# EasyEDA schematic BIT 2.json
TITLE: TRICORE | ALU | LOGIC; REV: 1.0; Date: 2022-01-06; Sheet: 4/9; Drawn By: Koehler, Paul; Company: komed3
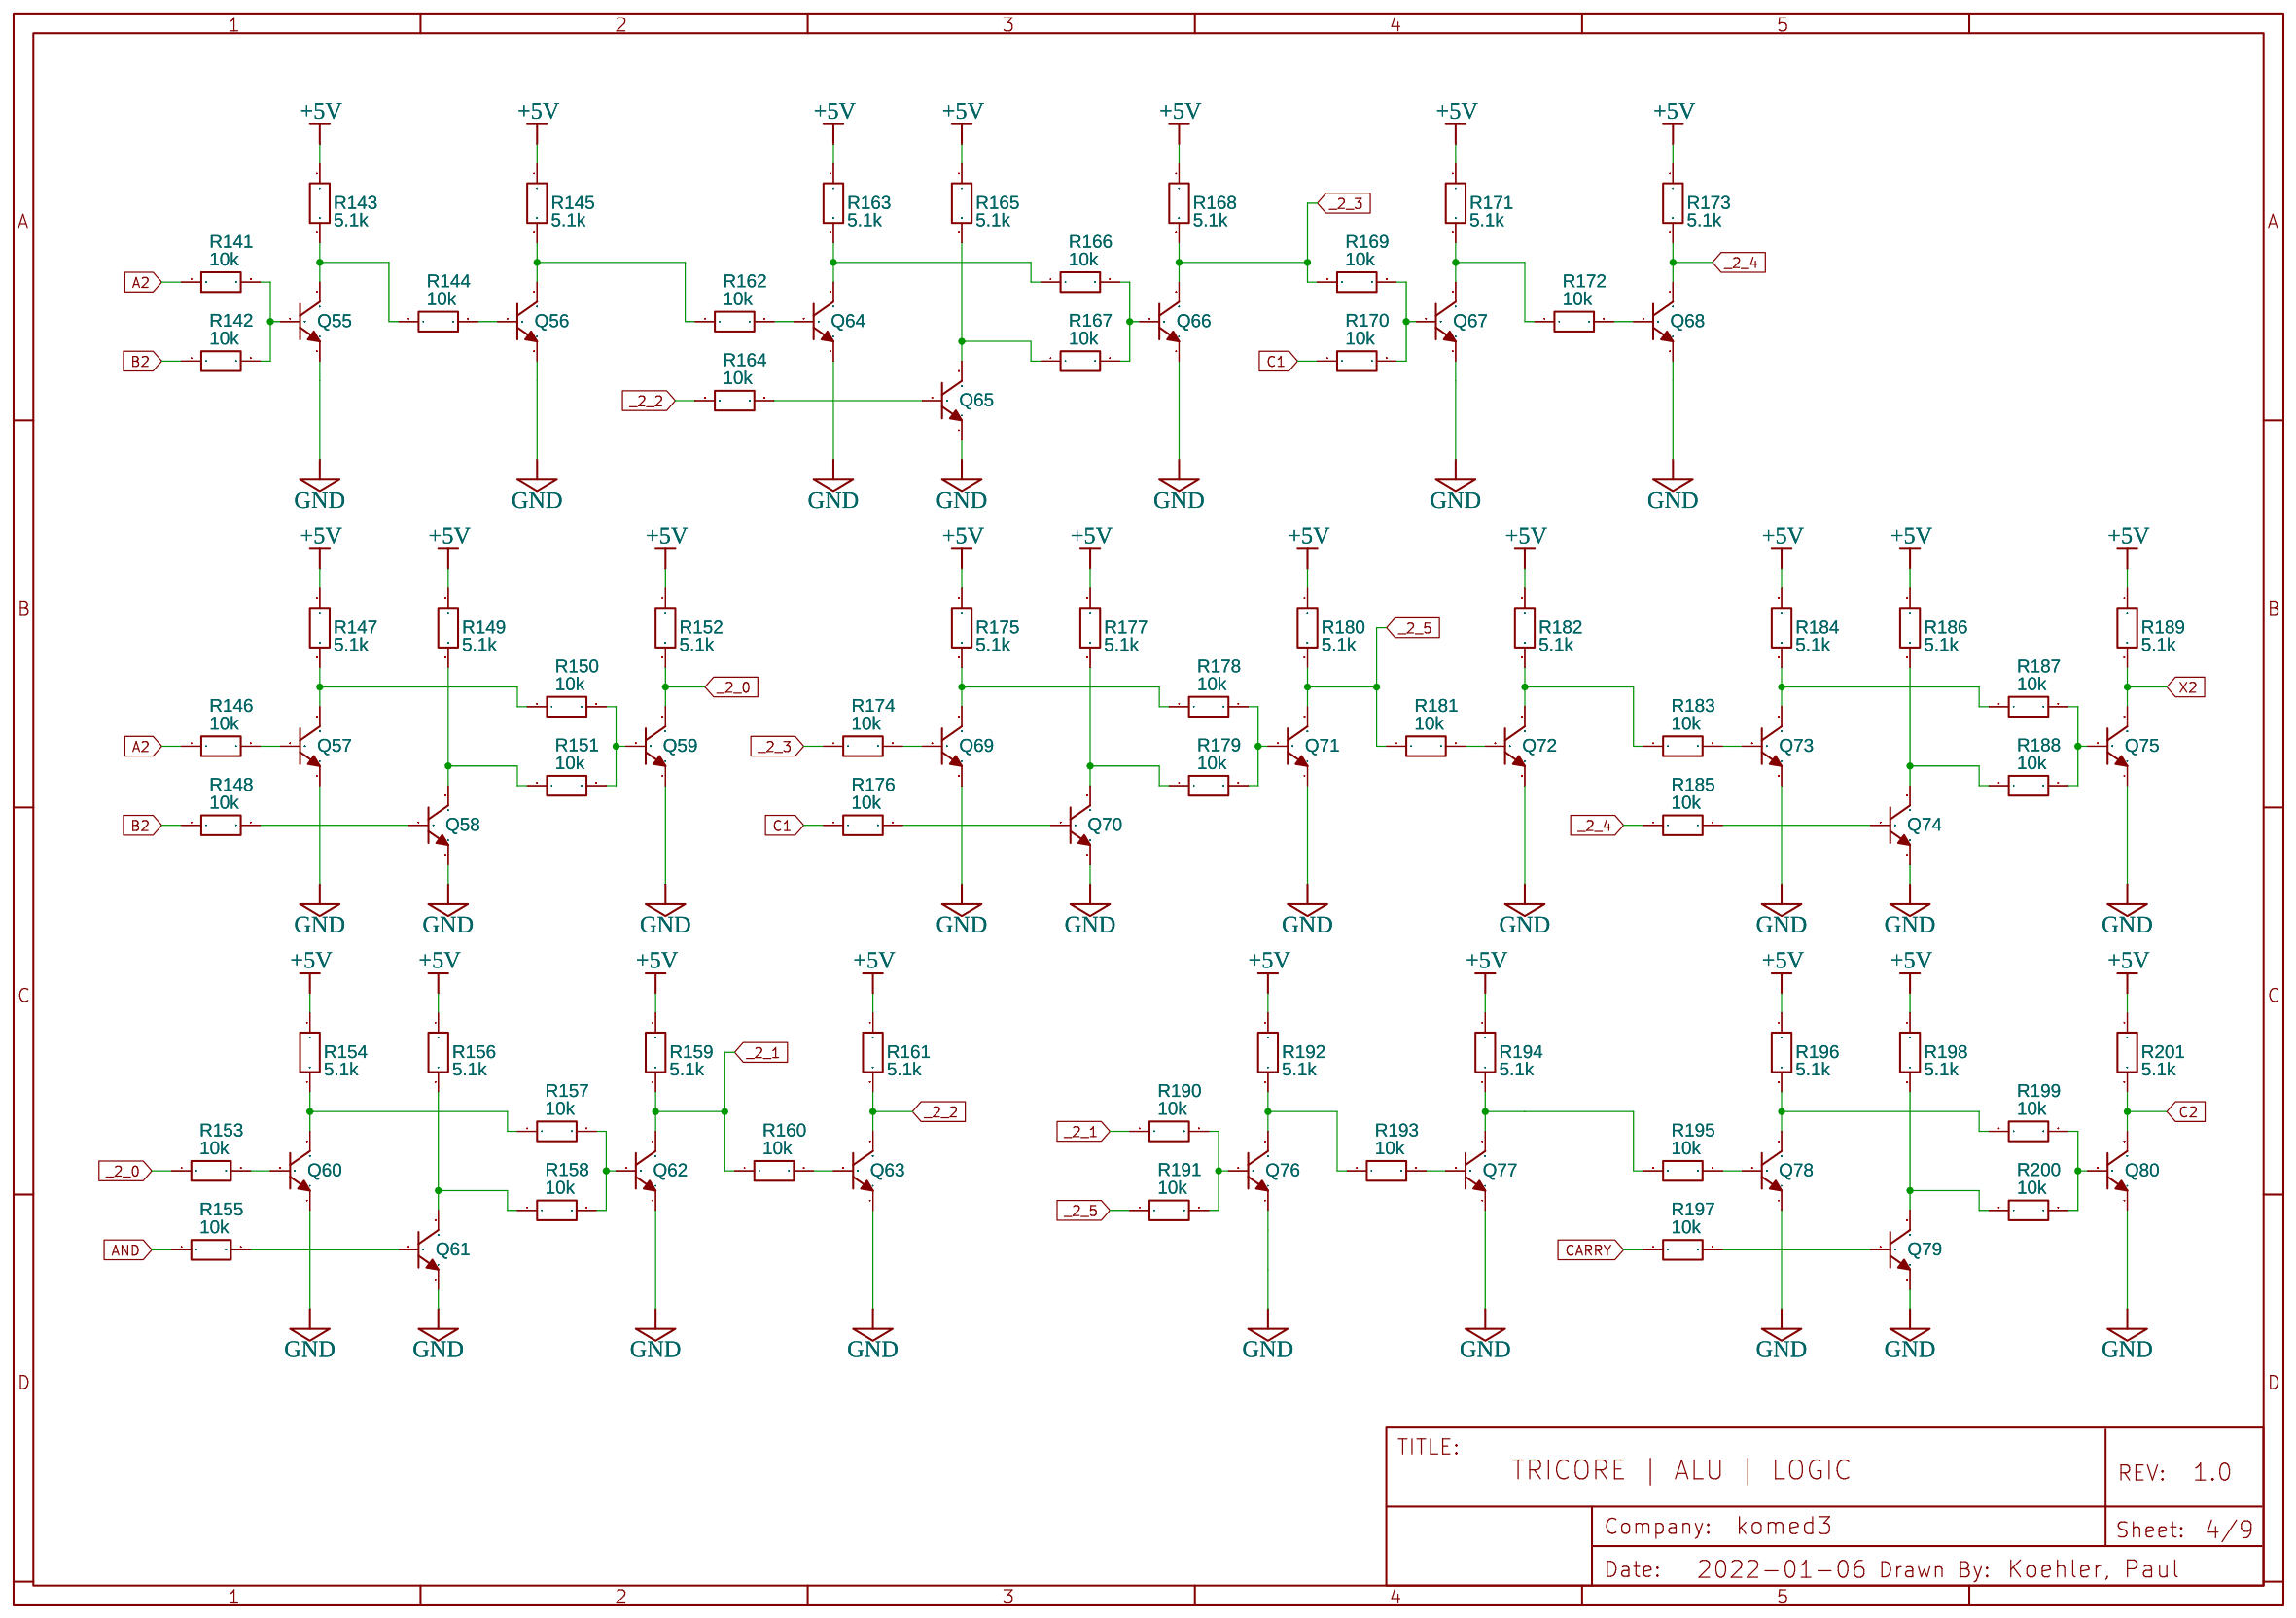
[diagram p0: schematic sheet]

## Parts
Q55  2N3904(TO-92)  [TO-92-3_L5.1-W4.1-P1.27-L]
Q56  2N3904(TO-92)  [TO-92-3_L5.1-W4.1-P1.27-L]
Q57  2N3904(TO-92)  [TO-92-3_L5.1-W4.1-P1.27-L]
Q58  2N3904(TO-92)  [TO-92-3_L5.1-W4.1-P1.27-L]
Q59  2N3904(TO-92)  [TO-92-3_L5.1-W4.1-P1.27-L]
Q60  2N3904(TO-92)  [TO-92-3_L5.1-W4.1-P1.27-L]
Q61  2N3904(TO-92)  [TO-92-3_L5.1-W4.1-P1.27-L]
Q62  2N3904(TO-92)  [TO-92-3_L5.1-W4.1-P1.27-L]
Q63  2N3904(TO-92)  [TO-92-3_L5.1-W4.1-P1.27-L]
Q64  2N3904(TO-92)  [TO-92-3_L5.1-W4.1-P1.27-L]
Q65  2N3904(TO-92)  [TO-92-3_L5.1-W4.1-P1.27-L]
Q66  2N3904(TO-92)  [TO-92-3_L5.1-W4.1-P1.27-L]
Q67  2N3904(TO-92)  [TO-92-3_L5.1-W4.1-P1.27-L]
Q68  2N3904(TO-92)  [TO-92-3_L5.1-W4.1-P1.27-L]
Q69  2N3904(TO-92)  [TO-92-3_L5.1-W4.1-P1.27-L]
Q70  2N3904(TO-92)  [TO-92-3_L5.1-W4.1-P1.27-L]
Q71  2N3904(TO-92)  [TO-92-3_L5.1-W4.1-P1.27-L]
Q72  2N3904(TO-92)  [TO-92-3_L5.1-W4.1-P1.27-L]
Q73  2N3904(TO-92)  [TO-92-3_L5.1-W4.1-P1.27-L]
Q74  2N3904(TO-92)  [TO-92-3_L5.1-W4.1-P1.27-L]
Q75  2N3904(TO-92)  [TO-92-3_L5.1-W4.1-P1.27-L]
Q76  2N3904(TO-92)  [TO-92-3_L5.1-W4.1-P1.27-L]
Q77  2N3904(TO-92)  [TO-92-3_L5.1-W4.1-P1.27-L]
Q78  2N3904(TO-92)  [TO-92-3_L5.1-W4.1-P1.27-L]
Q79  2N3904(TO-92)  [TO-92-3_L5.1-W4.1-P1.27-L]
Q80  2N3904(TO-92)  [TO-92-3_L5.1-W4.1-P1.27-L]
R141  10k  [R_AXIAL-0.3]
R142  10k  [R_AXIAL-0.3]
R143  5.1k  [R_AXIAL-0.3]
R144  10k  [R_AXIAL-0.3]
R145  5.1k  [R_AXIAL-0.3]
R146  10k  [R_AXIAL-0.3]
R147  5.1k  [R_AXIAL-0.3]
R148  10k  [R_AXIAL-0.3]
R149  5.1k  [R_AXIAL-0.3]
R150  10k  [R_AXIAL-0.3]
R151  10k  [R_AXIAL-0.3]
R152  5.1k  [R_AXIAL-0.3]
R153  10k  [R_AXIAL-0.3]
R154  5.1k  [R_AXIAL-0.3]
R155  10k  [R_AXIAL-0.3]
R156  5.1k  [R_AXIAL-0.3]
R157  10k  [R_AXIAL-0.3]
R158  10k  [R_AXIAL-0.3]
R159  5.1k  [R_AXIAL-0.3]
R160  10k  [R_AXIAL-0.3]
R161  5.1k  [R_AXIAL-0.3]
R162  10k  [R_AXIAL-0.3]
R163  5.1k  [R_AXIAL-0.3]
R164  10k  [R_AXIAL-0.3]
R165  5.1k  [R_AXIAL-0.3]
R166  10k  [R_AXIAL-0.3]
R167  10k  [R_AXIAL-0.3]
R168  5.1k  [R_AXIAL-0.3]
R169  10k  [R_AXIAL-0.3]
R170  10k  [R_AXIAL-0.3]
R171  5.1k  [R_AXIAL-0.3]
R172  10k  [R_AXIAL-0.3]
R173  5.1k  [R_AXIAL-0.3]
R174  10k  [R_AXIAL-0.3]
R175  5.1k  [R_AXIAL-0.3]
R176  10k  [R_AXIAL-0.3]
R177  5.1k  [R_AXIAL-0.3]
R178  10k  [R_AXIAL-0.3]
R179  10k  [R_AXIAL-0.3]
R180  5.1k  [R_AXIAL-0.3]
R181  10k  [R_AXIAL-0.3]
R182  5.1k  [R_AXIAL-0.3]
R183  10k  [R_AXIAL-0.3]
R184  5.1k  [R_AXIAL-0.3]
R185  10k  [R_AXIAL-0.3]
R186  5.1k  [R_AXIAL-0.3]
R187  10k  [R_AXIAL-0.3]
R188  10k  [R_AXIAL-0.3]
R189  5.1k  [R_AXIAL-0.3]
R190  10k  [R_AXIAL-0.3]
R191  10k  [R_AXIAL-0.3]
R192  5.1k  [R_AXIAL-0.3]
R193  10k  [R_AXIAL-0.3]
R194  5.1k  [R_AXIAL-0.3]
R195  10k  [R_AXIAL-0.3]
R196  5.1k  [R_AXIAL-0.3]
R197  10k  [R_AXIAL-0.3]
R198  5.1k  [R_AXIAL-0.3]
R199  10k  [R_AXIAL-0.3]
R200  10k  [R_AXIAL-0.3]
R201  5.1k  [R_AXIAL-0.3]

## Library data of the parts
Q55-Q80 = 2N3904(TO-92): Supplier: LCSC; Manufacturer: SEMTECH; Manufacturer Part: 2N3904; Supplier Part: C118538; Contributor: LCEDA_Lib
R141-R201 = R_AXIAL-0.3_EU: Contributor: LCEDA_Lib

## Nets
+5V: R143.1 R145.1 R147.1 R149.1 R152.1 R154.1 R156.1 R159.1 R161.1 R163.1 R165.1 R168.1 R171.1 R173.1 R175.1 R177.1 R180.1 R182.1 R184.1 R186.1 R189.1 R192.1 R194.1 R196.1 R198.1 R201.1
GND: Q55.1(E) Q56.1(E) Q57.1(E) Q58.1(E) Q59.1(E) Q60.1(E) Q61.1(E) Q62.1(E) Q63.1(E) Q64.1(E) Q65.1(E) Q66.1(E) Q67.1(E) Q68.1(E) Q69.1(E) Q70.1(E) Q71.1(E) Q72.1(E) Q73.1(E) Q74.1(E) Q75.1(E) Q76.1(E) Q77.1(E) Q78.1(E) Q79.1(E) Q80.1(E)
_2_0: Q59.3(C) R152.2 R153.1
_2_1: Q62.3(C) R159.2 R160.1 R190.1
_2_2: Q63.3(C) R161.2 R164.1
_2_3: Q66.3(C) R168.2 R169.1 R174.1
_2_4: Q68.3(C) R173.2 R185.1
_2_5: Q71.3(C) R180.2 R181.1 R191.1
A2: R141.1 R146.1
AND: R155.1
B2: R142.1 R148.1
C1: R170.1 R176.1
C2: Q80.3(C) R201.2
CARRY: R197.1
X2: Q75.3(C) R189.2
Net-(Q55-2): Q55.2(B) R141.2 R142.2
Net-(Q55-3): Q55.3(C) R143.2 R144.1
Net-(Q56-2): Q56.2(B) R144.2
Net-(Q56-3): Q56.3(C) R145.2 R162.1
Net-(Q57-2): Q57.2(B) R146.2
Net-(Q57-3): Q57.3(C) R147.2 R150.1
Net-(Q58-2): Q58.2(B) R148.2
Net-(Q58-3): Q58.3(C) R149.2 R151.1
Net-(Q59-2): Q59.2(B) R150.2 R151.2
Net-(Q60-2): Q60.2(B) R153.2
Net-(Q60-3): Q60.3(C) R154.2 R157.1
Net-(Q61-2): Q61.2(B) R155.2
Net-(Q61-3): Q61.3(C) R156.2 R158.1
Net-(Q62-2): Q62.2(B) R157.2 R158.2
Net-(Q63-2): Q63.2(B) R160.2
Net-(Q64-2): Q64.2(B) R162.2
Net-(Q64-3): Q64.3(C) R163.2 R166.1
Net-(Q65-2): Q65.2(B) R164.2
Net-(Q65-3): Q65.3(C) R165.2 R167.1
Net-(Q66-2): Q66.2(B) R166.2 R167.2
Net-(Q67-2): Q67.2(B) R169.2 R170.2
Net-(Q67-3): Q67.3(C) R171.2 R172.1
Net-(Q68-2): Q68.2(B) R172.2
Net-(Q69-2): Q69.2(B) R174.2
Net-(Q69-3): Q69.3(C) R175.2 R178.1
Net-(Q70-2): Q70.2(B) R176.2
Net-(Q70-3): Q70.3(C) R177.2 R179.1
Net-(Q71-2): Q71.2(B) R178.2 R179.2
Net-(Q72-2): Q72.2(B) R181.2
Net-(Q72-3): Q72.3(C) R182.2 R183.1
Net-(Q73-2): Q73.2(B) R183.2
Net-(Q73-3): Q73.3(C) R184.2 R187.1
Net-(Q74-2): Q74.2(B) R185.2
Net-(Q74-3): Q74.3(C) R186.2 R188.1
Net-(Q75-2): Q75.2(B) R187.2 R188.2
Net-(Q76-2): Q76.2(B) R190.2 R191.2
Net-(Q76-3): Q76.3(C) R192.2 R193.1
Net-(Q77-2): Q77.2(B) R193.2
Net-(Q77-3): Q77.3(C) R194.2 R195.1
Net-(Q78-2): Q78.2(B) R195.2
Net-(Q78-3): Q78.3(C) R196.2 R199.1
Net-(Q79-2): Q79.2(B) R197.2
Net-(Q79-3): Q79.3(C) R198.2 R200.1
Net-(Q80-2): Q80.2(B) R199.2 R200.2
